# Altium schematic sheet SH04 - OMAP-L137 SERIAL.SchDoc
size 386 x 246 mm
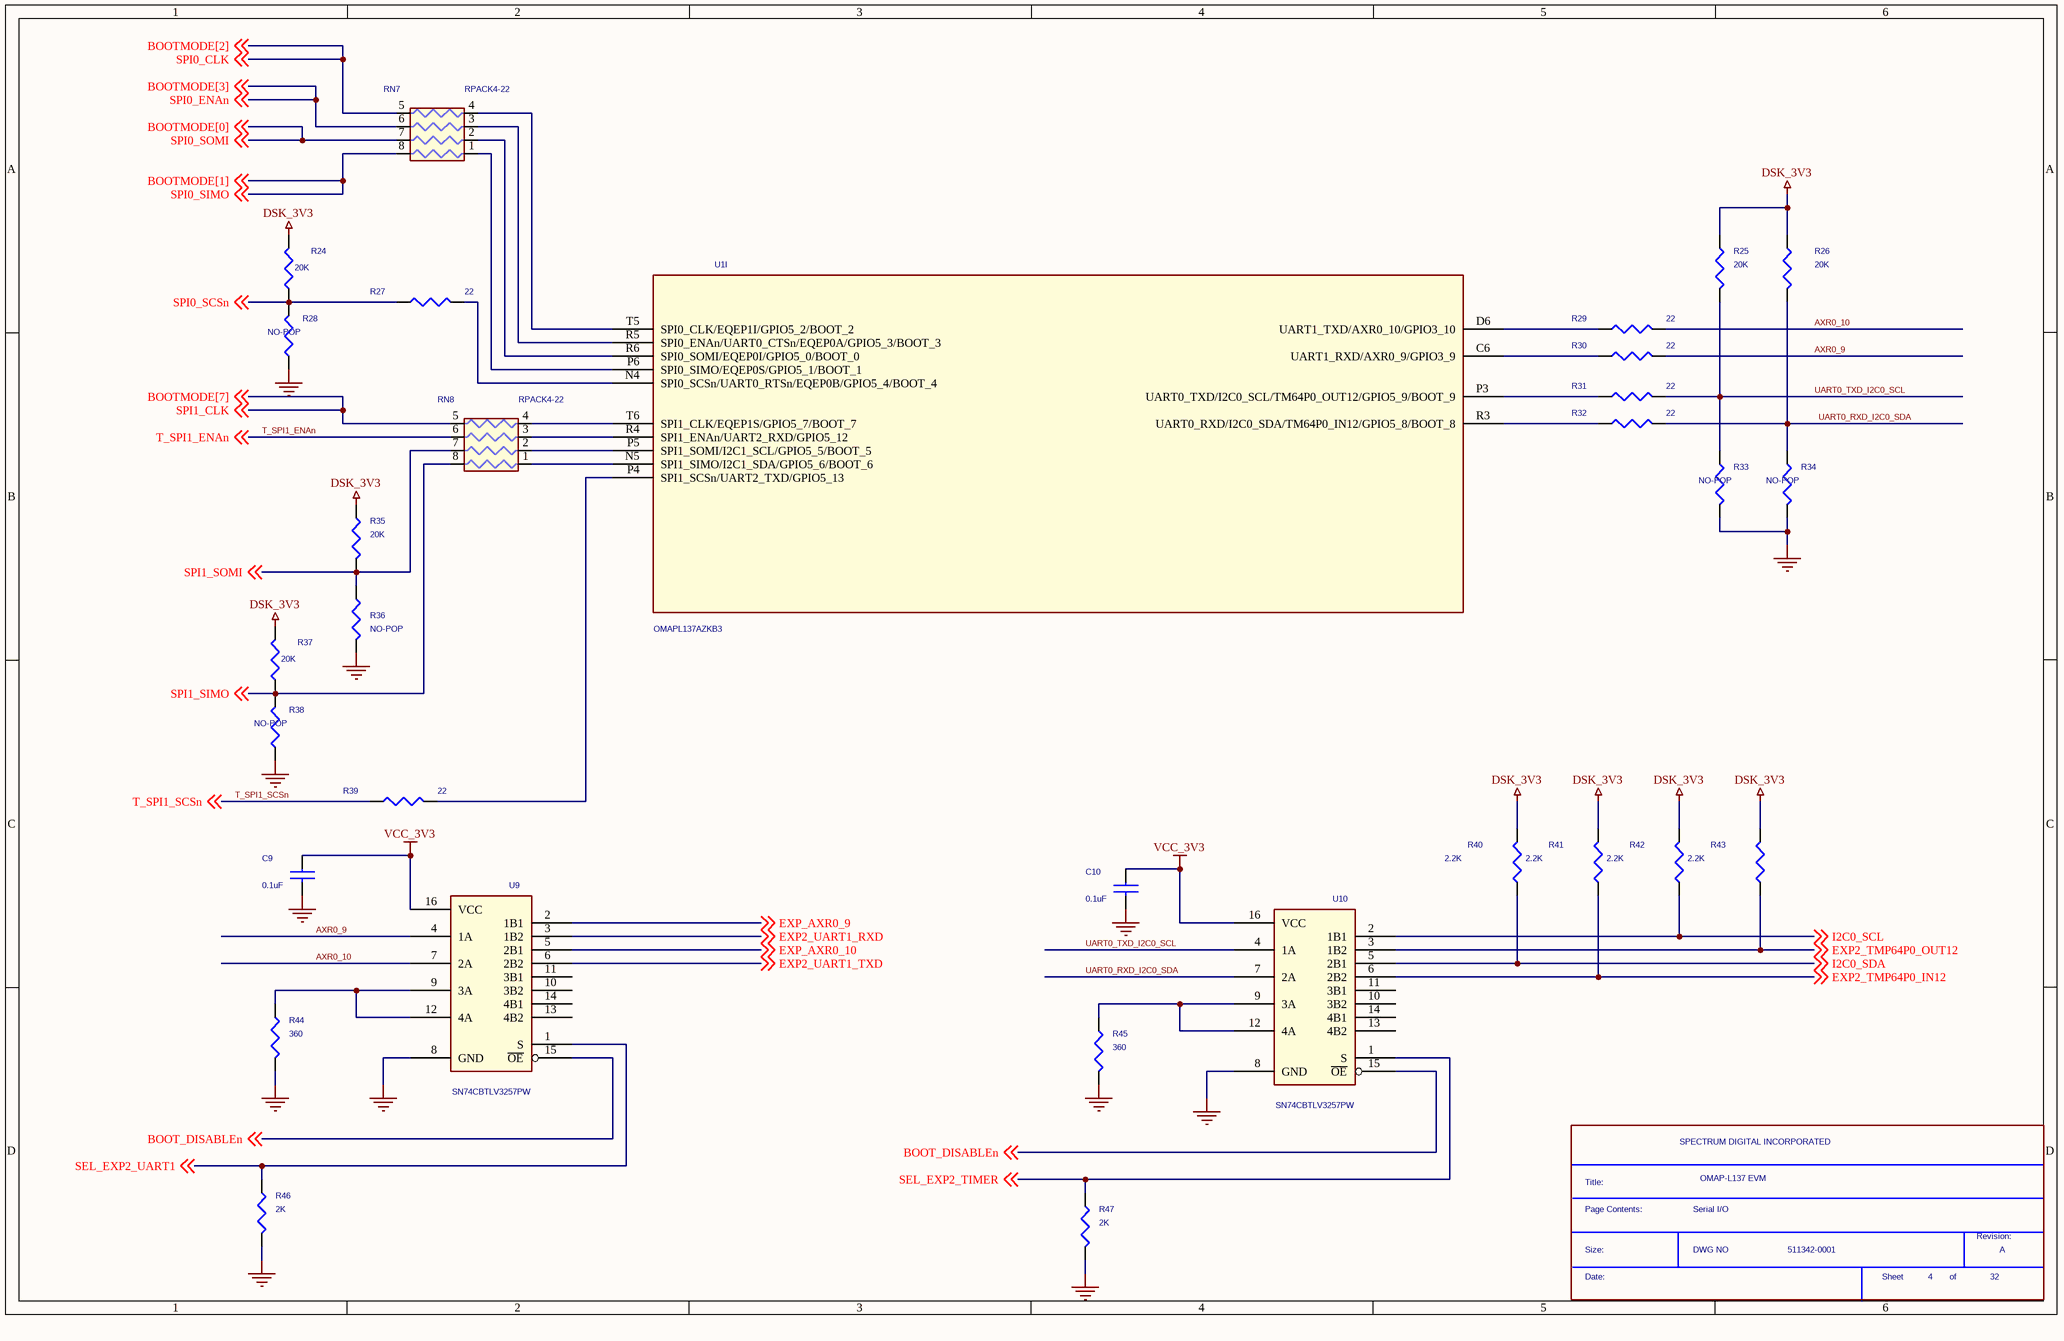
[diagram p0: SH04 - OMAP-L137 SERIAL.SchDoc]

## Parts
*  Page Contents:: Serial I/O  RevCode: A  Title: OMAP-L137 EVM  OrgName: SPECTRUM DIGITAL INCORPORATED  Doc: 511342-0001  Page Number: 4  Page Count: 32  (hidden comment: SDTitleBlock)  (graphical)
C9  0.1uF  [c402-25]
C10  0.1uF  [c402-25]
R24  20K  [r402-25]
R25  20K  [r402-25]
R26  20K  [r402-25]
R27  22  [r402-25]
R28  NO-POP  [r402-25]
R29  22  [r402-25]
R30  22  [r402-25]
R31  22  [r402-25]
R32  22  [r402-25]
R33  NO-POP  [r402-25]
R34  NO-POP  [r402-25]
R35  20K  [r402-25]
R36  NO-POP  [r402-25]
R37  20K  [r402-25]
R38  NO-POP  [r402-25]
R39  22  [r402-25]
R40  2.2K  [r402-25]
R41  2.2K  [r402-25]
R42  2.2K  [r402-25]
R43  2.2K  [r402-25]
R44  360  [r402-25]
R45  360  [r402-25]
R46  2K  [r402-25]
R47  2K  [r402-25]
RN7  RPACK4-22  [rpak8-10x25-28v]
RN8  RPACK4-22  [rpak8-10x25-28v]
U1  OMAPL137AZKB3  [skt256-6064]  (part I of 9)
U9  SN74CBTLV3257PW  [TSSOP-16]
U10  SN74CBTLV3257PW  [TSSOP-16]

## Nets
DSK_3V3: R24.1 R25.1 R26.1 R35.1 R37.1 R40.1 R41.1 R42.1 R43.1
GND: C9.2 C10.2 R28.2 R33.1 R34.1 R36.2 R38.2 R44.2 R45.2 R46.2 R47.2 U9.8(GND) U10.8(GND)
VCC_3V3: C9.1 C10.1 U9.16(VCC) U10.16(VCC)
AXR0_9: R30.2 U9.4(1A)
AXR0_10: R29.2 U9.7(2A)
BOOT_DISABLEn: U9.15(~{OE}) U10.15(~{OE}) ; off-sheet BOOT_DISABLEn
BOOTMODE[0]: RN7.7(R2B) ; off-sheet BOOTMODE[0], off-sheet SPI0_SOMI  [also labelled SPI0_SOMI]
BOOTMODE[1]: RN7.8(R1B) ; off-sheet SPI0_SIMO, off-sheet BOOTMODE[1]  [also labelled SPI0_SIMO]
BOOTMODE[2]: RN7.5(R4B) ; off-sheet SPI0_CLK, off-sheet BOOTMODE[2]  [also labelled SPI0_CLK]
BOOTMODE[3]: RN7.6(R3B) ; off-sheet BOOTMODE[3], off-sheet SPI0_ENAn  [also labelled SPI0_ENAn]
BOOTMODE[7]: RN8.5(R4B) ; off-sheet SPI1_CLK, off-sheet BOOTMODE[7]  [also labelled SPI1_CLK]
EXP2_TMP64P0_IN12: R41.2 U10.6(2B2) ; off-sheet EXP2_TMP64P0_IN12
EXP2_TMP64P0_OUT12: R43.2 U10.3(1B2) ; off-sheet EXP2_TMP64P0_OUT12
EXP2_UART1_RXD: U9.3(1B2) ; off-sheet EXP2_UART1_RXD
EXP2_UART1_TXD: U9.6(2B2) ; off-sheet EXP2_UART1_TXD
EXP_AXR0_9: U9.2(1B1) ; off-sheet EXP_AXR0_9
EXP_AXR0_10: U9.5(2B1) ; off-sheet EXP_AXR0_10
I2C0_SCL: R42.2 U10.2(1B1) ; off-sheet I2C0_SCL
I2C0_SDA: R40.2 U10.5(2B1) ; off-sheet I2C0_SDA
SEL_EXP2_TIMER: R47.1 U10.1(S) ; off-sheet SEL_EXP2_TIMER
SEL_EXP2_UART1: R46.1 U9.1(S) ; off-sheet SEL_EXP2_UART1
SPI0_SCSn: R24.2 R27.1 R28.1 ; off-sheet SPI0_SCSn
SPI1_SIMO: R37.2 R38.1 RN8.8(R1B) ; off-sheet SPI1_SIMO
SPI1_SOMI: R35.2 R36.1 RN8.7(R2B) ; off-sheet SPI1_SOMI
T_SPI1_ENAn: RN8.6(R3B) ; off-sheet T_SPI1_ENAn
T_SPI1_SCSn: R39.1 ; off-sheet T_SPI1_SCSn
UART0_RXD_I2C0_SDA: R26.2 R32.2 R34.2 U10.7(2A)
UART0_TXD_I2C0_SCL: R25.2 R31.2 R33.2 U10.4(1A)
NetR27_2: R27.2 U1.N4(SPI0_SCSn/UART0_RTSn/EQEP0B/GPIO5_4/BOOT_4)
NetR29_1: R29.1 U1.D6(UART1_TXD/AXR0_10/GPIO3_10)
NetR30_1: R30.1 U1.C6(UART1_RXD/AXR0_9/GPIO3_9)
NetR31_1: R31.1 U1.P3(UART0_TXD/I2C0_SCL/TM64P0_OUT12/GPIO5_9/BOOT_9)
NetR32_1: R32.1 U1.R3(UART0_RXD/I2C0_SDA/TM64P0_IN12/GPIO5_8/BOOT_8)
NetR39_2: R39.2 U1.P4(SPI1_SCSn/UART2_TXD/GPIO5_13)
NetR44_1: R44.1 U9.9(3A) U9.12(4A)
NetR45_1: R45.1 U10.9(3A) U10.12(4A)
NetRN7_1: RN7.1(R1A) U1.P6(SPI0_SIMO/EQEP0S/GPIO5_1/BOOT_1)
NetRN7_2: RN7.2(R2A) U1.R6(SPI0_SOMI/EQEP0I/GPIO5_0/BOOT_0)
NetRN7_3: RN7.3(R3A) U1.R5(SPI0_ENAn/UART0_CTSn/EQEP0A/GPIO5_3/BOOT_3)
NetRN7_4: RN7.4(R4A) U1.T5(SPI0_CLK/EQEP1I/GPIO5_2/BOOT_2)
NetRN8_1: RN8.1(R1A) U1.N5(SPI1_SIMO/I2C1_SDA/GPIO5_6/BOOT_6)
NetRN8_2: RN8.2(R2A) U1.P5(SPI1_SOMI/I2C1_SCL/GPIO5_5/BOOT_5)
NetRN8_3: RN8.3(R3A) U1.R4(SPI1_ENAn/UART2_RXD/GPIO5_12)
NetRN8_4: RN8.4(R4A) U1.T6(SPI1_CLK/EQEP1S/GPIO5_7/BOOT_7)

Not connected (* = marked no-connect by the designer): U9 10(3B2) 11(3B1) 13(4B2) 14(4B1); U10 10(3B2) 11(3B1) 13(4B2) 14(4B1)

## Notes on the sheet
- (in symbol SDTitleBlock) Title:; Page Contents:; Revision:; Size:; DWG NO; Date:; Sheet; of

## Library data of the parts
C9 C10 = CAP NP: Part #: 101587-1100R
R24-R26 R35 R37 = R_1: Part #: 101370-2003R
R27 R29-R32 R39 = R_1: Part #: 101370-2200R
R28 R33 R34 R36 R38 = R_1: Part #: R0402-NOPOP
R40-R43 = R: Part #: 101370-2202R
R44 R45 = R: Part #: 101370-3601R
R46 R47 = R: Part #: 101370-2002R
RN7 RN8 = R-Pak4_0: Part #: 101327-2200R
U1 = PRIMUS_BGA_1: Part #: 102772-0001; SWAP_INFO: (S1+S2+S3+S4+S5+S6+S7+S8+S9); SPLIT_INST: TRUE
U9 U10 = SN74CBT3257PW: IC, Quad 2-1 Multiplexer; Part #: 101670-0001R; Mfg: TI